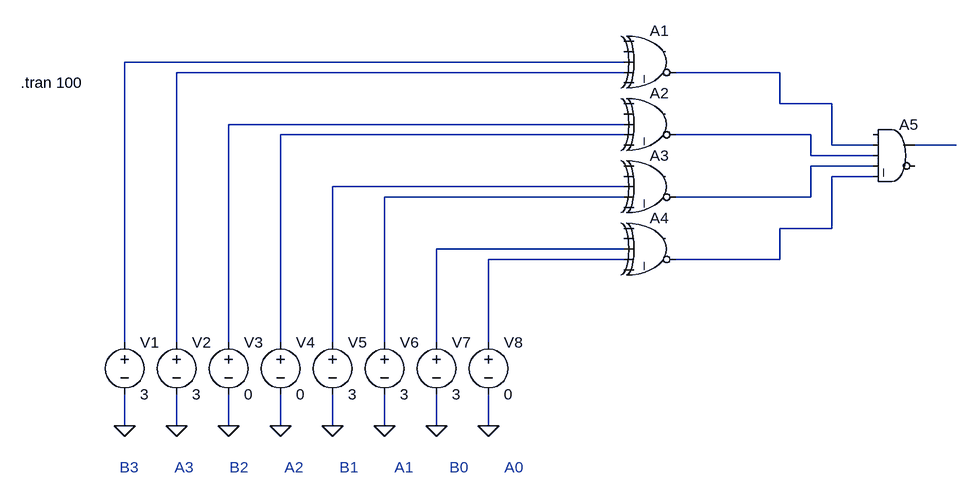
[diagram p0: schematic Actividad_2.asc]
Actividad_2.asc, the LTspice schematic file:
Version 4
SHEET 1 5572 680
WIRE 4880 -6864 4112 -6864
WIRE 4880 -6848 4192 -6848
WIRE 5120 -6848 4960 -6848
WIRE 5120 -6800 5120 -6848
WIRE 5200 -6800 5120 -6800
WIRE 4880 -6768 4272 -6768
WIRE 4880 -6752 4352 -6752
WIRE 5168 -6752 4960 -6752
WIRE 5200 -6736 5200 -6800
WIRE 5264 -6736 5200 -6736
WIRE 5392 -6736 5328 -6736
WIRE 5168 -6720 5168 -6752
WIRE 5264 -6720 5168 -6720
WIRE 5264 -6704 5168 -6704
WIRE 5264 -6688 5200 -6688
WIRE 4880 -6672 4432 -6672
WIRE 4880 -6656 4512 -6656
WIRE 5168 -6656 5168 -6704
WIRE 5168 -6656 4960 -6656
WIRE 5200 -6608 5200 -6688
WIRE 5200 -6608 5120 -6608
WIRE 4880 -6576 4592 -6576
WIRE 4880 -6560 4672 -6560
WIRE 5120 -6560 5120 -6608
WIRE 5120 -6560 4960 -6560
WIRE 4112 -6432 4112 -6864
WIRE 4192 -6432 4192 -6848
WIRE 4272 -6432 4272 -6768
WIRE 4352 -6432 4352 -6752
WIRE 4432 -6432 4432 -6672
WIRE 4512 -6432 4512 -6656
WIRE 4592 -6432 4592 -6576
WIRE 4672 -6432 4672 -6560
WIRE 4112 -6304 4112 -6352
WIRE 4192 -6304 4192 -6352
WIRE 4272 -6304 4272 -6352
WIRE 4352 -6304 4352 -6352
WIRE 4432 -6304 4432 -6352
WIRE 4512 -6304 4512 -6352
WIRE 4592 -6304 4592 -6352
WIRE 4672 -6304 4672 -6352
FLAG 4112 -6304 0
FLAG 4192 -6304 0
FLAG 4272 -6304 0
FLAG 4352 -6304 0
FLAG 4432 -6304 0
FLAG 4512 -6304 0
FLAG 4592 -6304 0
FLAG 4672 -6304 0
SYMBOL Digital\\xor 4928 -6928 R0
SYMATTR InstName A1
SYMBOL Digital\\xor 4928 -6832 R0
SYMATTR InstName A2
SYMBOL Digital\\xor 4928 -6736 R0
SYMATTR InstName A3
SYMBOL Digital\\xor 4928 -6640 R0
SYMATTR InstName A4
SYMBOL Digital\\and 5296 -6784 R0
SYMATTR InstName A5
SYMBOL voltage 4112 -6448 R0
WINDOW 123 0 0 Left 2
WINDOW 39 0 0 Left 2
SYMATTR InstName V1
SYMATTR Value 3
SYMBOL voltage 4192 -6448 R0
WINDOW 123 0 0 Left 2
WINDOW 39 0 0 Left 2
SYMATTR InstName V2
SYMATTR Value 3
SYMBOL voltage 4272 -6448 R0
WINDOW 123 0 0 Left 2
WINDOW 39 0 0 Left 2
SYMATTR InstName V3
SYMATTR Value 0
SYMBOL voltage 4352 -6448 R0
WINDOW 123 0 0 Left 2
WINDOW 39 0 0 Left 2
SYMATTR InstName V4
SYMATTR Value 0
SYMBOL voltage 4432 -6448 R0
WINDOW 123 0 0 Left 2
WINDOW 39 0 0 Left 2
SYMATTR InstName V5
SYMATTR Value 3
SYMBOL voltage 4512 -6448 R0
WINDOW 123 0 0 Left 2
WINDOW 39 0 0 Left 2
SYMATTR InstName V6
SYMATTR Value 3
SYMBOL voltage 4592 -6448 R0
WINDOW 123 0 0 Left 2
WINDOW 39 0 0 Left 2
SYMATTR InstName V7
SYMATTR Value 3
SYMBOL voltage 4672 -6448 R0
WINDOW 123 0 0 Left 2
WINDOW 39 0 0 Left 2
SYMATTR InstName V8
SYMATTR Value 0
TEXT 4104 -6240 Left 2 ;B3        A3        B2        A2        B1        A1        B0        A0
TEXT 3952 -6832 Left 2 !.tran 100

The netlist it stands for:
* Actividad_2.asc
A1 0 0 N001 N002 0 N003 0 0 XOR
A2 0 0 N004 N005 0 N006 0 0 XOR
A3 0 0 N010 N011 0 N008 0 0 XOR
A4 0 0 N012 N013 0 N009 0 0 XOR
A5 0 N003 N006 N008 N009 0 N007 0 AND
V1 N001 0 3
V2 N002 0 3
V3 N004 0 0
V4 N005 0 0
V5 N010 0 3
V6 N011 0 3
V7 N012 0 3
V8 N013 0 0
* B3        A3        B2        A2        B1        A1        B0        A0
.tran 100
.backanno
.end